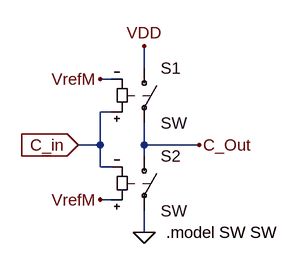
[diagram p0: schematic CompShift.asc]
CompShift.asc, the LTspice schematic file:
Version 4
SHEET 1 880 680
WIRE 208 0 208 -32
WIRE 160 16 144 16
WIRE 160 64 144 64
WIRE 144 112 144 64
WIRE 144 112 112 112
WIRE 208 112 208 80
WIRE 288 112 208 112
WIRE 208 128 208 112
WIRE 144 144 144 112
WIRE 160 144 144 144
WIRE 160 192 144 192
WIRE 208 240 208 208
FLAG 112 112 C_in
IOPIN 112 112 In
FLAG 144 16 VrefM
FLAG 208 -32 VDD
FLAG 288 112 C_Out
FLAG 144 192 VrefM
FLAG 208 240 0
SYMBOL sw 208 -16 R0
SYMATTR InstName S1
SYMBOL sw 208 112 R0
SYMATTR InstName S2
TEXT 240 240 Left 2 !.model SW SW

The netlist it stands for:
* CompShift.asc
S1 VDD C_Out C_in VrefM SW
S2 C_Out 0 VrefM C_in SW
.model SW SW
.backanno
.end